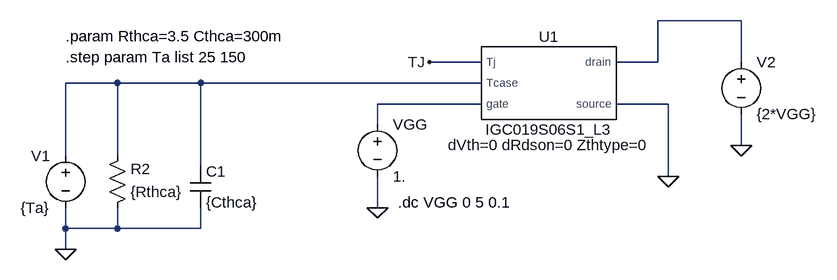
[diagram p0: schematic IGC_thermal.asc]
IGC_thermal.asc, the LTspice schematic file:
Version 4
SHEET 1 880 688
WIRE 576 64 448 64
WIRE 176 128 96 128
WIRE 448 128 448 64
WIRE 448 128 384 128
WIRE 576 128 576 64
WIRE -384 160 -464 160
WIRE -256 160 -384 160
WIRE 176 160 -256 160
WIRE 176 192 16 192
WIRE 464 192 384 192
WIRE 16 224 16 192
WIRE 576 256 576 208
WIRE -464 272 -464 160
WIRE -384 272 -384 160
WIRE -256 288 -256 160
WIRE 464 304 464 192
WIRE 16 352 16 304
WIRE -464 384 -464 352
WIRE -384 384 -384 352
WIRE -384 384 -464 384
WIRE -256 384 -256 352
WIRE -256 384 -384 384
WIRE -464 416 -464 384
FLAG 16 352 0
FLAG 576 256 0
FLAG 464 304 0
FLAG -464 416 0
FLAG 96 128 TJ
SYMBOL voltage -464 256 M0
WINDOW 123 0 0 Left 0
WINDOW 39 0 0 Left 0
SYMATTR InstName V1
SYMATTR Value {Ta}
SYMBOL voltage 16 208 R0
WINDOW 123 0 0 Left 0
WINDOW 39 0 0 Left 0
SYMATTR InstName VGG
SYMATTR Value 1.
SYMBOL res -400 368 M180
WINDOW 0 36 76 Left 2
WINDOW 3 36 40 Left 2
SYMATTR InstName R2
SYMATTR Value {Rthca}
SYMBOL voltage 576 112 R0
WINDOW 123 0 0 Left 0
WINDOW 39 0 0 Left 0
SYMATTR InstName V2
SYMATTR Value {2*VGG}
SYMBOL cap -272 288 R0
SYMATTR InstName C1
SYMATTR Value {Cthca}
SYMBOL IGC019S06S1_L3 272 160 R0
SYMATTR InstName U1
TEXT -464 88 Left 2 !.param Rthca=3.5 Cthca=300m
TEXT 48 344 Left 2 !.dc VGG 0 5 0.1
TEXT -464 120 Left 2 !.step param Ta list 25 150

The netlist it stands for:
* IGC_thermal.asc
V1 N002 0 {Ta}
VGG N003 0 1.
R2 0 N002 {Rthca}
V2 N001 0 {2*VGG}
C1 N002 0 {Cthca}
XU1 N001 N003 0 TJ N002 IGC019S06S1_L3 dVth=0 dRdson=0 Zthtype=0  ; pins drain gate source Tj Tcase
.param Rthca=3.5 Cthca=300m
.dc VGG 0 5 0.1
.step param Ta list 25 150
.lib ./CoolGaN.lib
.backanno
.end